# Altium schematic sheet 新板子布线图.SchDoc
size A3; PageSetup: Record=PageOptions|CenterHorizontal=True|CenterVertical=True|PrintScale=1.00|XCorrection=1.00|YCorrection=1.00|PrintKind=1|BorderSize=5000000|LeftOffset=0|BottomOffset=0|Orientation=2|PaperLength=1000|PaperWidth=1000|Scale=100|PaperSource=7|PrintQuality=-4|MediaType=1|DitherType=10|PaperKind=A3|PrintScaleMode=1
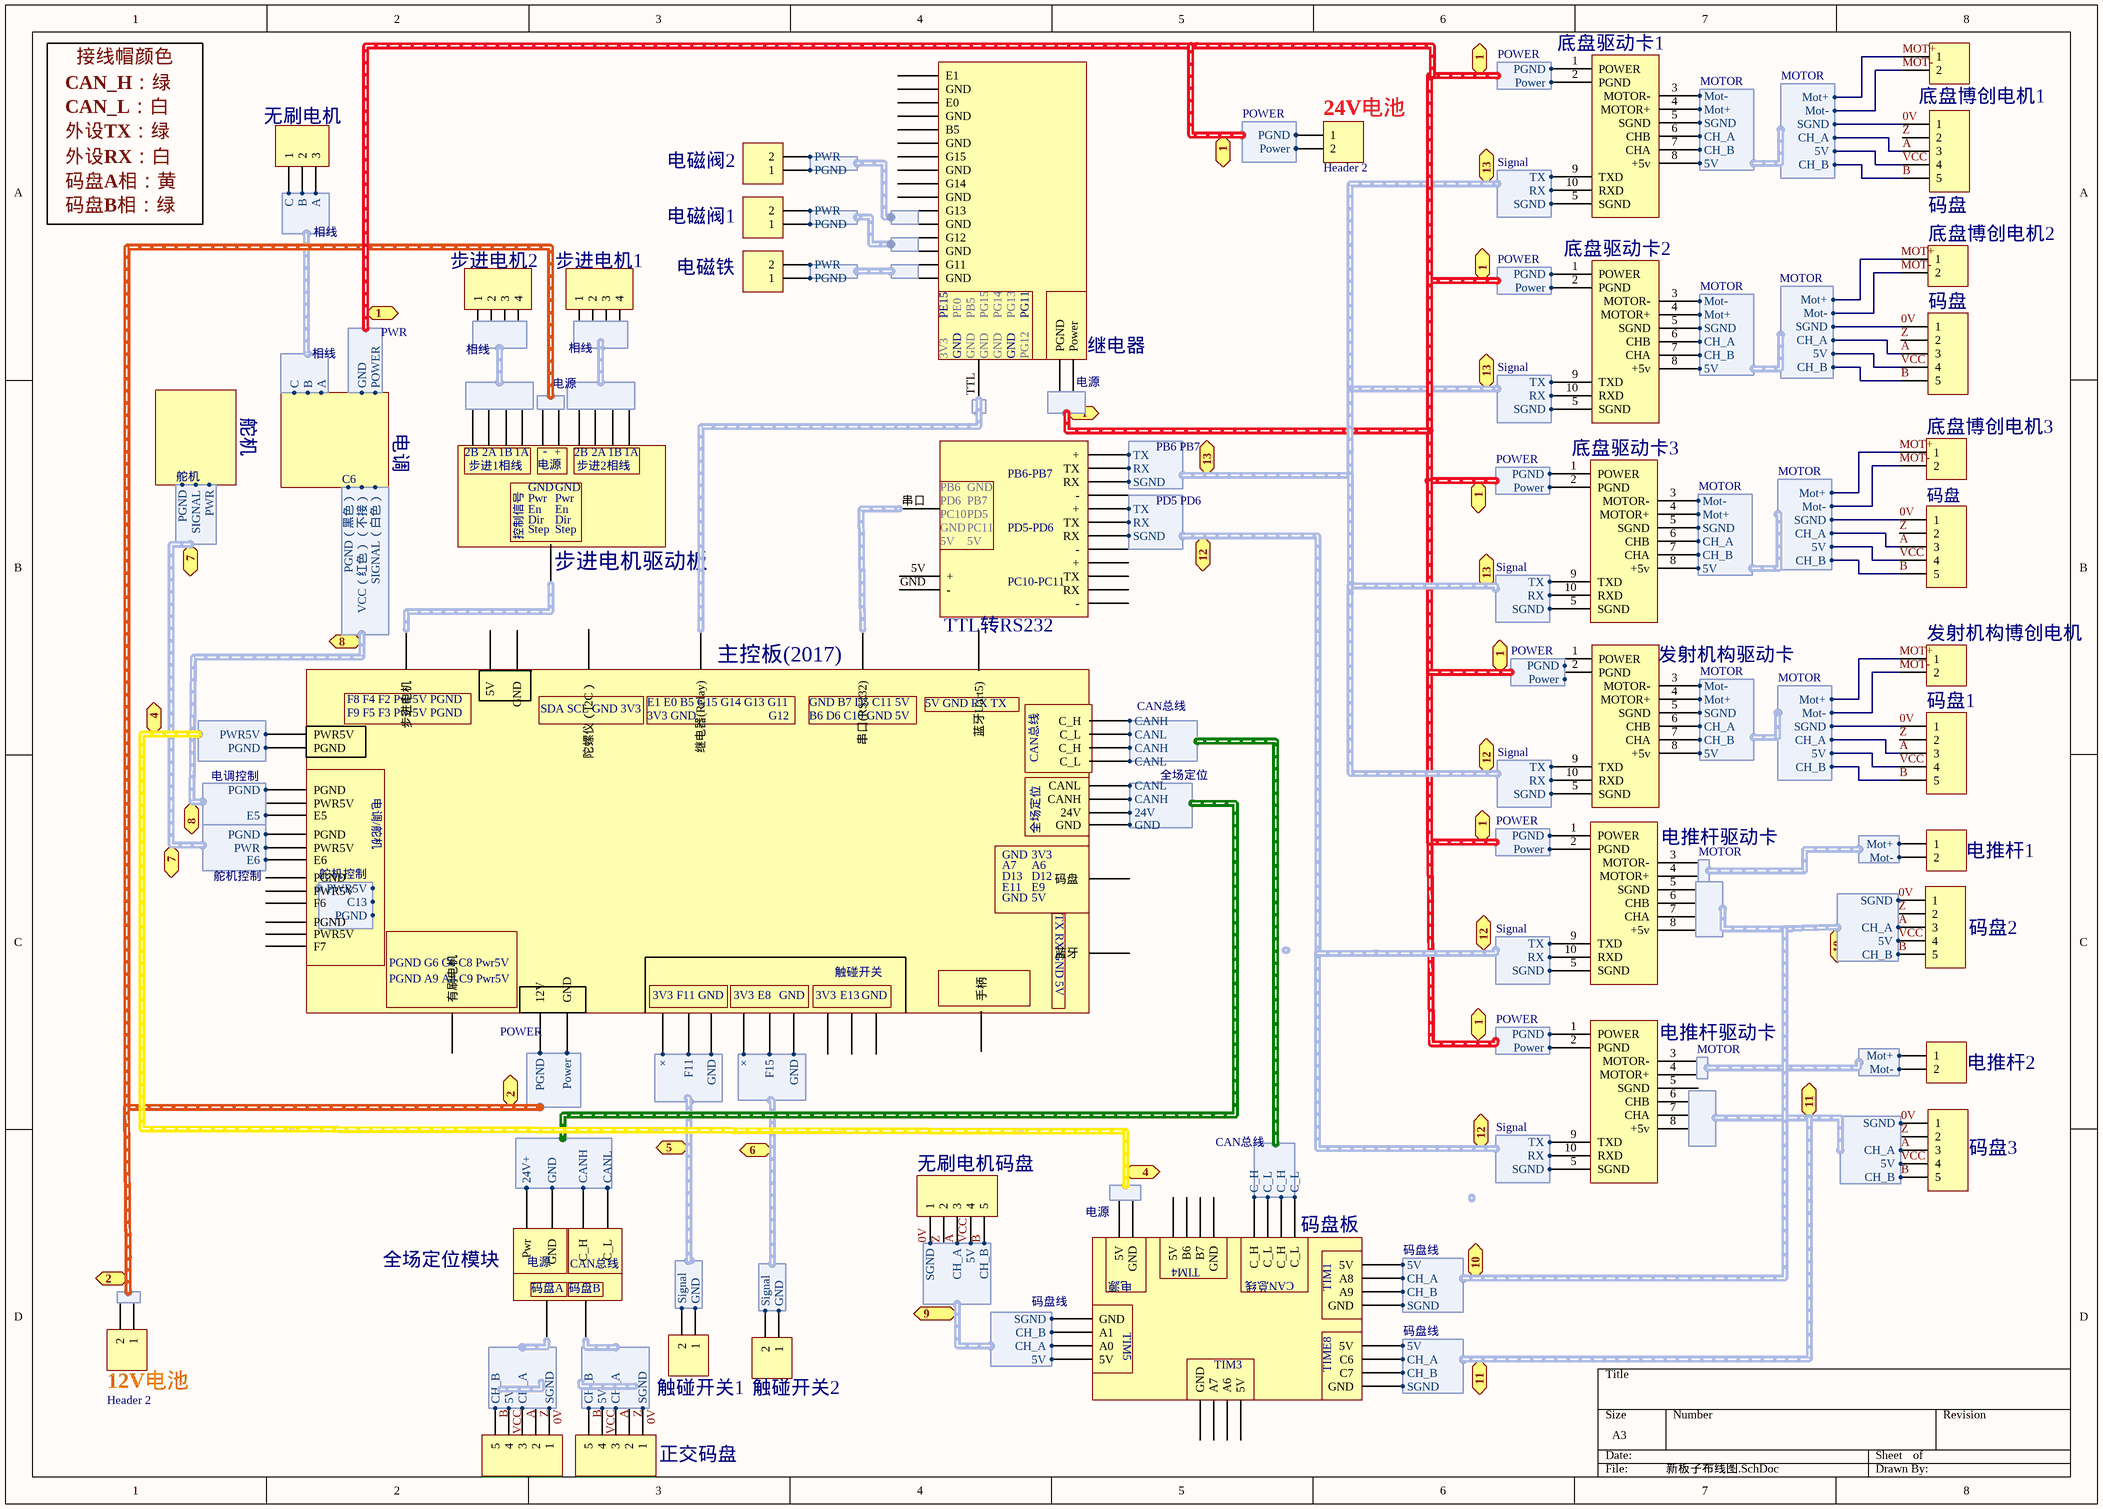
[diagram p0: 新板子布线图.SchDoc]

## Parts
(Parts that share a designator on the sheet are numbered #1, #2 ... from top to bottom, then left to right.)
12V电池  Header 2  [J2-白色接口]
24V电池  Header 2  [J2-白色接口]
*#1  底盘驱动卡1
*#2  底盘驱动卡2
*#3  继电器
*#4  步进电机驱动板
*#5  主控板(2017)
*#6  全场定位模块
*#7  码盘板
?  底盘驱动卡3
TTL转RS232  RS232(2016)  (value not drawn)
发射机构博创电机  Header 2  [J2-白色接口]  (value not drawn)
发射机构驱动卡  (no value)
底盘博创电机1  Header 2  [J2-白色接口]  (value not drawn)
底盘博创电机2  Header 2  [J2-白色接口]  (value not drawn)
底盘博创电机3  Header 2  [J2-白色接口]  (value not drawn)
无刷电机  Header 3  (value not drawn)
无刷电机码盘  Header 5  [HDR1X5]  (value not drawn)
正交码盘  Header 5  [HDR1X5]  (value not drawn)
步进电机1  Header 4  (value not drawn)
步进电机2  Header 4  (value not drawn)
电推杆1  Header 2  [J2-白色接口]  (value not drawn)
电推杆2  Header 2  [J2-白色接口]  (value not drawn)
电推杆驱动卡#1  (no value)
电推杆驱动卡#2  (no value)
电磁铁  Header 2  [J2-白色接口]  (value not drawn)
电磁阀1  Header 2  [J2-白色接口]  (value not drawn)
电磁阀2  Header 2  [J2-白色接口]  (value not drawn)
码盘1  Header 5  [HDR1X5]  (value not drawn)
码盘2  Header 5  [HDR1X5]  (value not drawn)
码盘3  Header 5  [HDR1X5]  (value not drawn)
码盘#1  Header 5  [HDR1X5]  (value not drawn)
码盘#2  Header 5  [HDR1X5]  (value not drawn)
码盘#3  Header 5  [HDR1X5]  (value not drawn)
码盘A  Header 5  [HDR1X5]  (value not drawn)
触碰开关1  Header 2  [J2-白色接口]  (value not drawn)
触碰开关2  Header 2  [J2-白色接口]  (value not drawn)

## Ports
1 (harness POWER), 1 (harness 电源), 2 (harness 电源), 4, 4 (harness 电源), 5, 6, 7 (harness 舵机控制), 8 (harness 电调控制), 9 (harness 码盘线), 10 (harness 码盘线), 11 (harness 码盘线), 12 (harness Signal), 13 (harness Signal)

## Harnesses
Signal: TX, RX, SGND
PB6 PB7: RX, TX, SGND
PD5 PD6: TX, RX, SGND
POWER: PGND, Power
MOTOR: CH_B, CH_A, SGND, 5V, Mot-, Mot+
全场定位: CANL, CANH, 24V, GND
舵机控制: PWR5V, C13, PGND
舵机: PGND, SIGNAL, PWR
电调控制: PGND, E5
C6: PGND（黑色）, VCC（红色）（不接）, SIGNAL（白色）
PWR: POWER, GND
相线: A, B, C
?: PGND, PWR5V
Harness: 
Harness: PGND, PWR
CAN总线: CANH, CANL, CANH, CANL
CAN总线: C_H, C_L, C_H, C_L
舵机控制: PWR, E6, PGND
码盘线: CH_B, CH_A, SGND, 5V
电源: 
MOTOR: CH_B, CH_A, SGND, 5V
?: 24V+, GND, CANH, CANL
相线: C, B, A
?: Mot+, Mot-
MOTOR: 
相线: 
?: Signal, GND
?: F11, GND, ×
?: F15, GND, ×

## Nets
0V: *#1.5(SGND) *#2.5(SGND) *#7.TTL(GND) ?.5(SGND) 发射机构驱动卡.5(SGND) 无刷电机码盘.1 正交码盘.1 码盘1.1 码盘2.1 码盘3.1 码盘#1.1 码盘#2.1 码盘#3.1 码盘A.1 ; harness MOTOR.SGND, port 10.SGND, port 11.SGND, port 9.SGND
A: *#1.6(CHB) *#2.6(CHB) *#7.TTL(A8) ?.6(CHB) 发射机构驱动卡.6(CHB) 无刷电机码盘.3 正交码盘.3 码盘1.3 码盘2.3 码盘3.3 码盘#1.3 码盘#2.3 码盘#3.3 码盘A.3 ; harness MOTOR.CH_A, port 10.CH_A, port 9.CH_A, port 11.CH_A
B: *#1.7(CHA) *#2.7(CHA) *#7.TTL(C7) ?.7(CHA) 发射机构驱动卡.7(CHA) 无刷电机码盘.5 正交码盘.5 码盘1.5 码盘2.5 码盘3.5 码盘#1.5 码盘#2.5 码盘#3.5 码盘A.5 ; harness MOTOR.CH_B, port 10.CH_B, port 11.CH_B, port 9.CH_B
MOT+: *#1.4(MOTOR+) *#2.4(MOTOR+) ?.4(MOTOR+) 发射机构博创电机.1 发射机构驱动卡.4(MOTOR+) 底盘博创电机1.1 底盘博创电机2.1 底盘博创电机3.1 ; harness MOTOR.Mot+
MOT-: *#1.3(MOTOR-) *#2.3(MOTOR-) ?.3(MOTOR-) 发射机构博创电机.2 发射机构驱动卡.3(MOTOR-) 底盘博创电机1.2 底盘博创电机2.2 底盘博创电机3.2 ; harness MOTOR.Mot-
VCC: *#1.8(+5v) *#2.8(+5v) *#7.TTL(5V) ?.8(+5v) 发射机构驱动卡.8(+5v) 无刷电机码盘.4 正交码盘.4 码盘1.4 码盘2.4 码盘3.4 码盘#1.4 码盘#2.4 码盘#3.4 码盘A.4 ; harness MOTOR.5V, port 10.5V, port 11.5V, port 9.5V
Z: 无刷电机码盘.2 正交码盘.2 码盘1.2 码盘2.2 码盘3.2 码盘#1.2 码盘#2.2 码盘#3.2 码盘A.2
Net24V电池_1: 24V电池.1 *#1.1(POWER) *#2.1(POWER) ?.1(POWER) 电推杆驱动卡#1.1(POWER) 电推杆驱动卡#2.1(POWER) ; port 1.PGND
Net24V电池_2: 24V电池.2 *#1.2(PGND) *#2.2(PGND) ?.2(PGND) 电推杆驱动卡#1.2(PGND) 电推杆驱动卡#2.2(PGND) ; port 1.Power, port 1.POWER
Net*#1_5: *#1.5(SGND) *#2.5(SGND) ?.5(SGND) TTL转RS232.?3(RX) TTL转RS232.?7(RX) 发射机构驱动卡.5(SGND) 电推杆驱动卡#1.5(SGND) 电推杆驱动卡#2.5(SGND) ; port 12.SGND
Net*#1_9: *#1.9(TXD) *#2.9(TXD) ?.9(TXD) TTL转RS232.?1(+) TTL转RS232.?5(+) 发射机构驱动卡.9(TXD) 电推杆驱动卡#1.9(TXD) 电推杆驱动卡#2.9(TXD) ; port 12.TX
Net*#1_10: *#1.10(RXD) *#2.10(RXD) ?.10(RXD) TTL转RS232.?2(TX) TTL转RS232.?6(TX) 发射机构驱动卡.10(RXD) 电推杆驱动卡#1.10(RXD) 电推杆驱动卡#2.10(RXD) ; port 12.RX
Net*#5_6: *#5.6(PWR5V) ; port 4.PWR5V
Net*#5_6: *#5.6(12V) ; port 2.PGND  [a separate net that carries the same name]
Net*#5_6: *#5.6(GND) ; port 2.Power  [a separate net that carries the same name]
Net*#5_6: *#5.6(PWR5V) ; port 7.PWR  [a separate net that carries the same name]
Net*#5_7: *#5.7(PGND) ; port 4.PGND
Net*#5_7: *#5.7(PGND) ; port 8.PGND  [a separate net that carries the same name]
Net*#5_7: *#5.7(E5) ; port 8.E5  [a separate net that carries the same name]
Net*#5_7: *#5.7(PGND) ; port 7.PGND  [a separate net that carries the same name]
Net*#5_7: *#5.7(E6) ; port 7.E6  [a separate net that carries the same name]
Net*#5_TTL: *#5.TTL(CANH) *#6.TTL(C_H) ; harness 全场定位.CANH, harness ?.CANH
Net*#5_TTL: *#5.TTL(CANL) *#6.TTL(C_L) ; harness 全场定位.CANL, harness ?.CANL  [a separate net that carries the same name]
Net*#5_TTL: *#5.TTL(GND) *#6.TTL(GND) ; harness 全场定位.GND, harness ?.GND  [a separate net that carries the same name]
Net*#5_TTL: *#5.TTL(C_L) ; harness CAN总线.CANL  [a separate net that carries the same name]
Net*#5_TTL: *#5.TTL(C_H) ; harness CAN总线.CANH  [a separate net that carries the same name]
Net*#5_TTL: *#5.TTL ; harness ?.F11  [a separate net that carries the same name]
Net*#5_TTL: *#5.TTL ; harness ?.×  [a separate net that carries the same name]
Net*#5_TTL: *#5.TTL ; harness ?.GND  [a separate net that carries the same name]
Net*#5_TTL: *#5.TTL ; port 6.F15  [a separate net that carries the same name]
Net*#5_TTL: *#5.TTL ; port 6.×  [a separate net that carries the same name]
Net*#5_TTL: *#5.TTL 触碰开关2.1 ; port 6.GND  [a separate net that carries the same name]
Net*#5_TTL: *#5.TTL(24V) ; harness 全场定位.24V  [a separate net that carries the same name]
Net*#6_TTL: *#6.TTL(Pwr) ; harness ?.24V+
Net*#7_TTL: *#7.TTL(C_L) ; harness CAN总线.C_L
Net*#7_TTL: *#7.TTL(C_H) ; harness CAN总线.C_H  [a separate net that carries the same name]
Net无刷电机_1: 无刷电机.1 ; harness 相线.C
Net无刷电机_2: 无刷电机.2 ; harness 相线.B
Net无刷电机_3: 无刷电机.3 ; harness 相线.A
Net电推杆1_1: 电推杆1.1 ; harness ?.Mot+
Net电推杆1_2: 电推杆1.2 ; harness ?.Mot-
Net电推杆2_1: 电推杆2.1 ; harness ?.Mot+
Net电推杆2_2: 电推杆2.2 ; harness ?.Mot-
Net电磁铁_1: 电磁铁.1 ; harness Harness.PGND
Net电磁铁_2: 电磁铁.2 ; harness Harness.PWR
Net电磁阀1_1: 电磁阀1.1 ; harness Harness.PGND
Net电磁阀1_2: 电磁阀1.2 ; harness Harness.PWR
Net电磁阀2_1: 电磁阀2.1 ; harness Harness.PGND
Net电磁阀2_2: 电磁阀2.2 ; harness Harness.PWR
Net触碰开关1_1: 触碰开关1.1 ; port 5.GND
Net触碰开关1_2: 触碰开关1.2 ; port 5.Signal
Net触碰开关2_2: 触碰开关2.2 ; port 6.Signal

Not connected (* = marked no-connect by the designer): 12V电池 1 2; *#3 ?1(Power) GND TTL; *#4 TTL; *#5 ?1(继电器(Relay)) ?2(串口(RS232)) ?3(5V) ?4(GND) ?5(蓝牙Uart5)) ?6(蓝牙); TTL转RS232 5V(+) ?4(-) ?8(-) ?9(+) ?10(TX) ?11(RX) ?12(-) GND(-) 串口; 发射机构驱动卡 1(POWER) 2(PGND); 步进电机1 1 2 3 4; 步进电机2 1 2 3 4; 电推杆驱动卡#1 3(MOTOR-) 4(MOTOR+) 6(CHB) 7(CHA) 8(+5v); 电推杆驱动卡#2 3(MOTOR-) 4(MOTOR+) 6(CHB) 7(CHA) 8(+5v)

## Buses and harness runs
harness port 12 = port 13

## Notes on the sheet
- CAN_H：绿
- CAN_L：白
- 接线帽颜色
- 外设TX：绿
- 外设RX：白
- 码盘A相：黄
- 码盘B相：绿
- 舵机
- 电调
- (in symbol Relay) PE15; PE0; PB5; PG15; PG14; PG13; PG11; 3V3; PG12
- (in symbol RS232(2016)) PB6-PB7; PB6; PD6; PB7; PC10; PD5; PC11; PD5-PD6; PC10-PC11
- (in symbol 主控板(2017)) F8 F4 F2 Pwr5V PGND; E1 E0 B5 G15 G14 G13 G11; GND B7 D5 C11 5V; SDA SCL GND 3V3; 5V GND RX TX; F9 F5 F3 Pwr5V PGND; 3V3 GND; G12; B6 D6 C10 GND 5V; CAN总线; 电调/舵机; 全场定位; 3V3; A7; A6; D13; D12; E11; E9; TX RX GND 5V; PGND G6 C6 C8 Pwr5V; 触碰开关; PGND A9 A8 C9 Pwr5V; F11; E8; E13
- (in symbol 全场定位模块) 电源; CAN总线; 码盘A; 码盘B
- (in symbol 步进电机驱动板) 2B; 2A; 1B; 1A; -; +; 步进1相线; 电源; 步进2相线; GND; Pwr; En; Dir; 控制信号; Step
- (in symbol 码盘板) TIM4; 电源; CAN总线; TIM1; TIM5; TIM3; TIME8

## Library data of the parts
12V电池 24V电池 发射机构博创电机 底盘博创电机1-底盘博创电机3 电推杆1 电推杆2 电磁铁 电磁阀1 电磁阀2 触碰开关1 触碰开关2 = Header 2: Header, 2-Pin; LatestRevisionDate: 17-Jul-2002; LatestRevisionNote: Re-released for DXP Platform.; Publisher: Altium Limited
*#3 = Relay
无刷电机 = Header 3: Header, 3-Pin; LatestRevisionDate: 17-Jul-2002; LatestRevisionNote: Re-released for DXP Platform.; Publisher: Altium Limited
无刷电机码盘 正交码盘 码盘1-码盘3 码盘#1-码盘#3 码盘A = Header 5: Header, 5-Pin; LatestRevisionDate: 17-Jul-2002; LatestRevisionNote: Re-released for DXP Platform.; Publisher: Altium Limited
步进电机1 步进电机2 = Header 4: Header, 4-Pin; LatestRevisionDate: 17-Jul-2002; LatestRevisionNote: Re-released for DXP Platform.; Publisher: Altium Limited